# EAGLE design Carduino_328 (EAGLE 6.4)
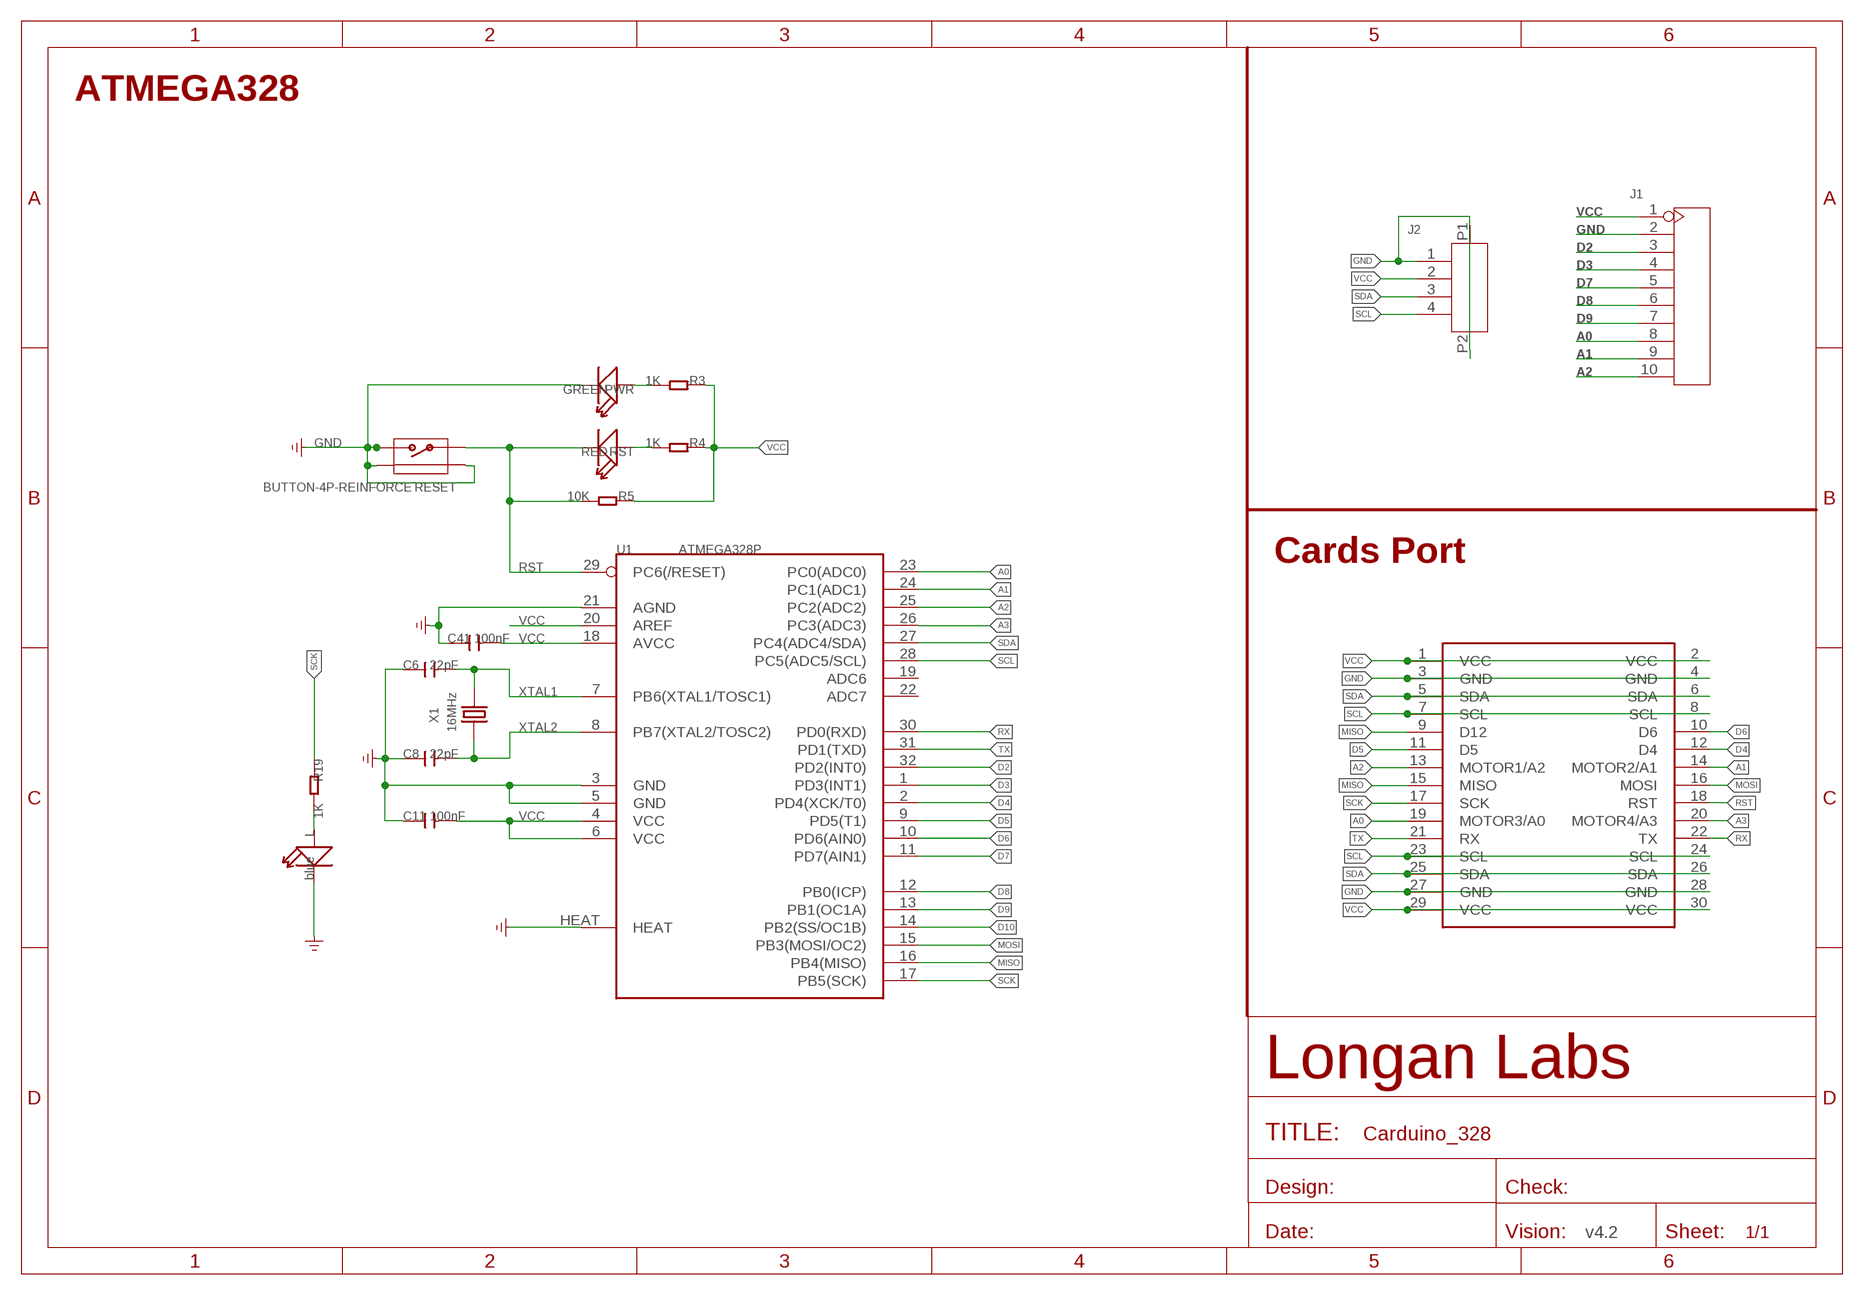
[diagram p0: schematic, sheet 1]

## Parts
C6  22pF  C-0603  [C0603]
C8  22pF  C-0603  [C0603]
C11  100nF  C-0603  [C0603]
C41  100nF  C-0603  [C0603]
J1  HEADER-10P-2.54  [H10-2.54]
J2  HEADER-4P-1.0  [4P-1.0-90D]
L  blue  LED'0603'  [LED-0603]
MOUDLE1  MOUDLE-2X15P-MCU'BOARD'  [MOUDLE-2X15P-2.54]
PWR  GREEN  LED'0603'  [LED-0603]
R3  1K  R-0603  [R0603]
R4  1K  R-0603  [R0603]
R5  10K  R-0603  [R0603]
R19  1K  R-0603  [R0603]
RESET  BUTTON-4P-REINFORCE  BUTTON-4P-REINFORCE'TS-1188E'  [4P-SMD-7X3.5X3.5H]
RST  RED  LED'0603'  [LED-0603]
U1  ATMEGA328P  MEGA8  [MLF32X]
X1  16MHz  CRYSTAL'5032'  [2P-SMD-5X3.2]

## Nets
A0: J1.8 MOUDLE1.19(MOTOR3/A0) U1.23(PC0(ADC0))
A1: J1.9 MOUDLE1.14(MOTOR2/A1) U1.24(PC1(ADC1))
A2: J1.10 MOUDLE1.13(MOTOR1/A2) U1.25(PC2(ADC2))
A3: MOUDLE1.20(MOTOR4/A3) U1.26(PC3(ADC3))
D2: J1.3 U1.32(PD2(INT0))
D3: J1.4 U1.1(PD3(INT1))
D4: MOUDLE1.12(D4) U1.2(PD4(XCK/T0))
D5: MOUDLE1.11(D5) U1.9(PD5(T1))
D6: MOUDLE1.10(D6) U1.10(PD6(AIN0))
D7: J1.5 U1.11(PD7(AIN1))
D8: J1.6 U1.12(PB0(ICP))
D9: J1.7 U1.13(PB1(OC1A))
D10: U1.14(PB2(SS/OC1B))
GND: C6.1 C8.1 C11.1 C41.1 J1.2 J2.1 J2.P1 J2.P2 L.- MOUDLE1.3(GND) MOUDLE1.4(GND) MOUDLE1.27(GND) MOUDLE1.28(GND) PWR.- RESET.2 RESET.S1 RESET.S2 U1.3(GND) U1.5(GND) U1.21(AGND) U1.HEAT ; supply symbol labelled GND_POWER
MISO: MOUDLE1.9(D12) MOUDLE1.15(MISO) U1.16(PB4(MISO))
MOSI: MOUDLE1.16(MOSI) U1.15(PB3(MOSI/OC2))
N$3: L.+ R19.2
N$7: PWR.+ R3.2
N$17: R4.2 RST.+
RST: MOUDLE1.18(RST) R5.2 RESET.1 RST.- U1.29(PC6(/RESET))
RX: MOUDLE1.22(TX) U1.30(PD0(RXD))
SCK: MOUDLE1.17(SCK) R19.1 U1.17(PB5(SCK))
SCL: J2.4 MOUDLE1.7(SCL) MOUDLE1.8(SCL) MOUDLE1.23(SCL) MOUDLE1.24(SCL) U1.28(PC5(ADC5/SCL))
SDA: J2.3 MOUDLE1.5(SDA) MOUDLE1.6(SDA) MOUDLE1.25(SDA) MOUDLE1.26(SDA) U1.27(PC4(ADC4/SDA))
TX: MOUDLE1.21(RX) U1.31(PD1(TXD))
VCC: C11.2 C41.2 J1.1 J2.2 MOUDLE1.1(VCC) MOUDLE1.2(VCC) MOUDLE1.29(VCC) MOUDLE1.30(VCC) R3.1 R4.1 R5.1 U1.4(VCC) U1.6(VCC) U1.18(AVCC) U1.20(AREF)
XTAL1: C6.2 U1.7(PB6(XTAL1/TOSC1)) X1.2
XTAL2: C8.2 U1.8(PB7(XTAL2/TOSC2)) X1.1
Unconnected: U1.19(ADC6) U1.22(ADC7)

## Notes on the sheet
- ATMEGA328
- Cards Port
- v4.2

## Library data of the parts
C6 C8 C11 C41 = Discrete:C*: Ceramic Capacitors
J1 = Connector-new:HEADER-10P
J2 = Longan-Connect:HEADER-4P-1.0
L PWR RST = Discrete:LED*
MOUDLE1 = Longan-moudle:MOUDLE-2X15P-MCU
R3-R5 R19 = Discrete:R*
RESET = Discrete:BUTTON-4P-REINFORCE: TS-1188E http://www.best-dz.com/?thread-374-2.html
U1 = ICs_v54:MEGA8
X1 = Discrete:CRYSTAL*: CRYSTAL

## Net classes
1 power: width 0.152 mm, drill 0.152 mm, clearance 0.152 mm
2 gnd: width 0.152 mm, drill 0.152 mm, clearance 0.152 mm
3 usbvcc: width 0.152 mm, drill 0.152 mm, clearance 0.152 mm

## Board
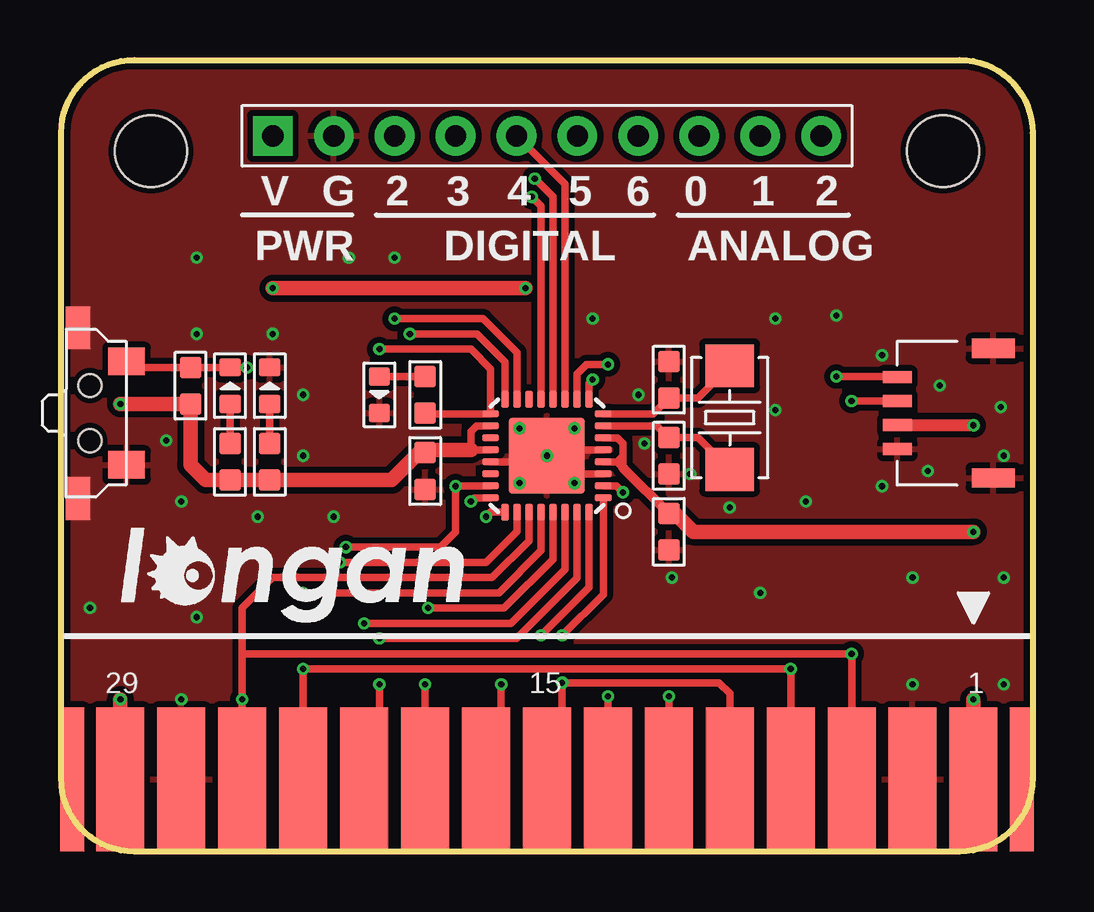
[diagram p1: board, top side]
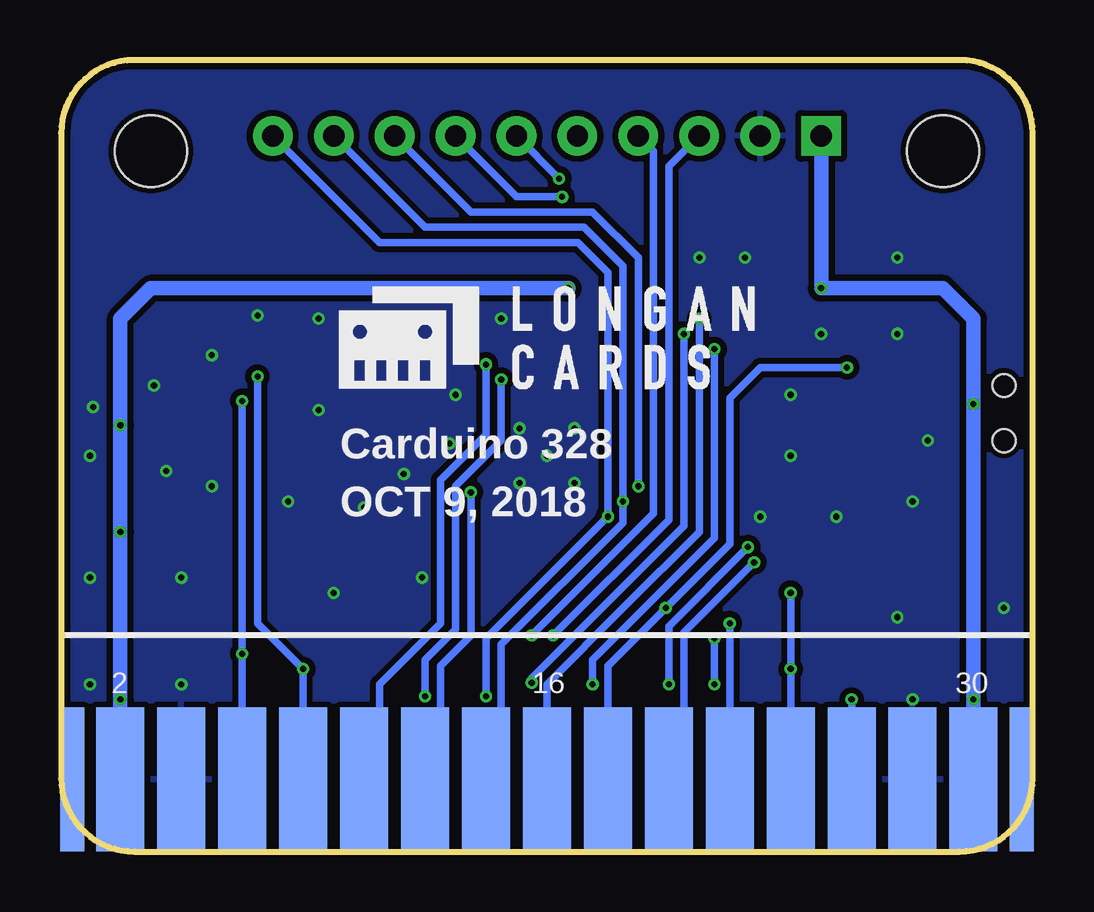
[diagram p2: board, bottom side, seen from below]

Size 40.5 x 33 mm. Coordinates in mm from the lower left corner, seen from the top.
Copper layers (1*16): Top 0.035mm / dielectric 1.5mm / Bottom 0.035mm
Design rules "SeeedStudio_2layer_DRU_no_angle_20140221": minimum track width 1mil, minimum drill 10mil, track to track 6mil, track to pad 6mil, pad to pad 6mil, via to via 6mil, smd to smd 0mil, copper to edge 10mil, drill to drill 10mil, minimum pad ring 4mil, minimum via ring 4mil, stop-mask expansion 2mil, vias tented up to drill 25mil, thermal gap 10mil

### Footprints (pad centres in the part's own frame; a part is rotated, then mirrored left to right if it is on the bottom)
C0603 = smd 0.889 x 0.889: 1 -0.762,0; 2 0.762,0
H10-2.54 = drill 0.889 pad 1.651 square: 1 0,11.43 | drill 0.889 pad 1.651: 2 0,8.89; 3 0,6.35; 4 0,3.81; 5 0,1.27; 6 0,-1.27; 7 0,-3.81; 8 0,-6.35; 9 0,-8.89; 10 0,-11.43
4P-1.0-90D = smd 1.2 x 0.5: 1 0,1.5; 2 0,0.5; 3 0,-0.5; 4 0,-1.5 | smd 1.8 x 0.8: P1 -4,2.7; P2 -4,-2.7
LED-0603 = smd 0.762 x 0.889: + -0.762,0; - 0.762,0
MOUDLE-2X15P-2.54 = smd 2 x 6: 1 17.78,-13.492; 3 15.24,-13.492; 5 12.7,-13.492; 7 10.16,-13.492; 9 7.62,-13.492; 11 5.08,-13.492; 13 2.54,-13.492; 15 0,-13.492; 17 -2.54,-13.492; 19 -5.08,-13.492; 21 -7.62,-13.492; 23 -10.16,-13.492; 25 -12.7,-13.492; 27 -15.24,-13.492; 29 -17.78,-13.492 | smd 2 x 6 bottom: 2 17.78,-13.492; 4 15.24,-13.492; 6 12.7,-13.492; 8 10.16,-13.492; 10 7.62,-13.492; 12 5.08,-13.492; 14 2.54,-13.492; 16 0,-13.492; 18 -2.54,-13.492; 20 -5.08,-13.492; 22 -7.62,-13.492; 24 -10.16,-13.492; 26 -12.7,-13.492; 28 -15.24,-13.492; 30 -17.78,-13.492 | smd 1 x 6: P1 -19.8,-13.492; P4 19.8,-13.492 | smd 1 x 6 bottom: P2 -19.8,-13.492; P3 19.8,-13.492 | hole 3: -16.51,12.7; 16.51,12.7
R0603 = smd 0.889 x 0.889: 1 -0.762,0; 2 0.762,0
4P-SMD-7X3.5X3.5H = smd 1.143 x 1.524: 1 -2.159,1.524; 2 2.159,1.524 | smd 1.778 x 1.016: S1 -3.556,-0.508; S2 3.556,-0.508 | hole 0.95: -1.15,0; 1.15,0
MLF32X = smd 0.7 x 0.3: 1 -2.35,1.75; 2 -2.35,1.25; 3 -2.35,0.75; 4 -2.35,0.25; 5 -2.35,-0.25; 6 -2.35,-0.75; 7 -2.35,-1.25; 8 -2.35,-1.75; 17 2.35,-1.75; 18 2.35,-1.25; 19 2.35,-0.75; 20 2.35,-0.25; 21 2.35,0.25; 22 2.35,0.75; 23 2.35,1.25; 24 2.35,1.75 | smd 0.3 x 0.7: 9 -1.75,-2.35; 10 -1.25,-2.35; 11 -0.75,-2.35; 12 -0.25,-2.35; 13 0.25,-2.35; 14 0.75,-2.35; 15 1.25,-2.35; 16 1.75,-2.35; 25 1.75,2.35; 26 1.25,2.35; 27 0.75,2.35; 28 0.25,2.35; 29 -0.25,2.35; 30 -0.75,2.35; 31 -1.25,2.35; 32 -1.75,2.35 | smd 3.175 x 3.175: HEAT 0,0
2P-SMD-5X3.2 = smd 1.778 x 2.032: 1 -2.159,0; 2 2.159,0

### Placement (x,y rotation side)
C6  25.33,16.5 90 top
C8  25.33,19.68 270 top
C11  25.33,13.32 90 top
C41  15.17,15.87 90 top
J1  20.25,29.84 90 top
J2  34.86,18.28 180 top
L  13.27,19.04 270 top
MOUDLE1  20.25,16.5 0 top
PWR  8.69,19.42 90 top
R3  8.69,16.25 90 top
R4  7.04,16.25 90 top
R5  5.39,19.42 90 top
R19  15.17,19.04 90 top
RESET  1.2,18.28 270 top
RST  7.04,19.42 90 top
U1  20.25,16.5 180 top
U$1  [LONGAN-CARDS-MIDDLE]  29.65,18.79 0 bottom
U$3  [LONGAN-SILK-SMALLER]  1.2,8.37 0 top
X1  27.87,18.09 270 top

### Tracks (layer width: path | path; a pad name or v marks a point on that pad's centre or on a via)
A0  (via drill 0.25 pad 0.51)
  Top 0.305: U1.23 16.46,15.25 v16.44,15.23 16.44,13.32 15.8,12.69 v11.87,12.69 | MOUDLE1.19 v15.17,6.97
  Bottom 0.305: v16.44,15.23 16.44,24.76 18.34,26.66 23.43,26.66 J1.8 | v15.17,6.97 15.17,9.39 v11.87,12.69
A1  (via drill 0.25 pad 0.51)
  Top 0.305: U1.24 17.23,14.75 v17.07,14.6
  Bottom 0.305: J1.9 25.33,26.02 18.7,26.02 17.07,24.4 v17.07,14.6 17.07,13.71 22.16,8.63 22.16,2.91 22.66,2.4 22.66,2.88 MOUDLE1.14 23.43,3.64
A2  (via drill 0.25 pad 0.51)
  Top 0.305: U1.25 17.9,14.15 v17.71,13.96 | v22.79,6.47 MOUDLE1.13
  Bottom 0.305: J1.10 27.23,25.39 18.96,25.39 17.71,24.14 v17.71,13.96 22.79,8.88 v22.79,6.47
A3  (via drill 0.25 pad 0.51)
  Top 0.305: U1.26 19,13.35 17.71,12.05 v11.61,12.05
  Bottom 0.305: MOUDLE1.20 15.17,4.94 14.54,5.58 14.54,9.13 v11.61,12.05
D2  (via drill 0.25 pad 0.51)
  Top 0.305: U1.32 22,11.01 v20,9.01
  Bottom 0.305: J1.3 15.17,28.56 15.17,13.83 v20,9.01
D3  (via drill 0.25 pad 0.51)
  Top 0.305: U1.1 22.6,10.72 v20.89,9.01
  Bottom 0.305: J1.4 15.8,29.2 15.8,14.09 v20.89,9.01
D4  (via drill 0.25 pad 0.51)
  Top 0.305: U1.2 23.15,15.25 v23.43,14.98
  Bottom 0.305: MOUDLE1.12 24.7,3.64 24.7,7.74 23.43,9.01 v23.43,14.98
D5  (via drill 0.25 pad 0.51)
  Top 0.305: MOUDLE1.11 25.33,4.69 | 25.33,4.69 25.96,5.32 | U1.9 22,19.52 v22.16,19.68 | v25.33,6.47 25.33,4.69
  Bottom 0.305: v25.33,6.47 25.33,7.99 24.06,9.26 24.06,15.23 22.16,17.14 v22.16,19.68
D6  (via drill 0.25 pad 0.51)
  Top 0.305: v22.79,20.31 21.9,20.31 21.5,19.91 U1.10
  Bottom 0.305: v22.79,20.31 22.79,17.39 24.7,15.48 24.7,9.52 27.23,6.97 27.23,3.64 MOUDLE1.10
D7
  Top 0.305: U1.11 21,27.81 J1.5
D8  (via drill 0.25 pad 0.51)
  Top 0.305: U1.12 20.5,27.3 v19.74,28.06
  Bottom 0.305: v19.74,28.06 J1.6
D9  (via drill 0.25 pad 0.51)
  Top 0.305: U1.13 20,21.48 20,21.83 20,26.91 v19.61,27.3
  Bottom 0.305: v19.61,27.3 21.52,27.3 J1.7
GND  (via drill 0.25 pad 0.51)
  Top 0.305: U1.21 20,16.25 U1.HEAT | U1.5 20.5,16.75 U1.HEAT | U1.3 20.36,15.75 20.12,15.99 20.12,16.37 U1.HEAT
  other vias: 20.25,16.5 19.11,17.64 19.11,15.36 21.39,15.36 21.39,17.64 8.19,13.96 5.01,14.6 5.64,24.76 32.31,22.34 39.3,16.5 34.22,20.69 8.82,21.58 5.64,21.58 4.38,17.14 5.01,6.34 5.64,9.77 11.99,24.76 13.9,24.76 39.17,18.53 29.14,10.79 29.77,18.41 29.77,22.21 36.63,19.42 35.49,11.42 35.49,6.97 39.3,11.42 1.2,10.15 10.09,19.04 10.09,16.5 11.36,13.96 36.12,15.87 34.22,15.23 24.31,17.01 26.22,15.74 27.87,14.34 31.05,14.6 22.16,22.21 39.3,6.97 25.46,11.42 24.06,19.04
  pour Bottom (isolate 0.254): -0.2,-0.14 41.71,-0.14 41.71,33.52 -0.2,33.52
  pour Top (isolate 0.254): -0.2,-0.14 41.71,-0.14 41.71,33.52 -0.2,33.52
MISO  (via drill 0.25 pad 0.51)
  Top 0.305: U1.16 18.5,20.41 17.33,21.58 v14.54,21.58 | MOUDLE1.9 27.87,6.59 27.43,7.04 v20.89,7.04 20.89,3.64 MOUDLE1.15
  Bottom 0.305: v14.54,21.58 14.54,13.58 20.89,7.23 v20.89,7.04
MOSI  (via drill 0.25 pad 0.51)
  Top 0.305: U1.15 19,20.8 17.58,22.21 v13.9,22.21
  Bottom 0.305: v13.9,22.21 13.9,13.32 17.07,10.15 20.25,6.97 MOUDLE1.16
N$3
  Top 0.305: R19.2 L.+
N$7
  Top 0.305: R3.2 PWR.+
N$17
  Top 0.305: R4.2 RST.+
RST  (via drill 0.25 pad 0.51)
  Top 0.305: U1.29 20.5,12.18 18.47,10.15 v15.3,10.15 | RESET.1 2.98,20.18 R5.2 RST.- v7.74,20.18
  Bottom 0.305: MOUDLE1.18 17.71,7.74 v15.3,10.15 12.63,12.82 12.63,18.91 11.36,20.18 v7.74,20.18
RX  (via drill 0.25 pad 0.51)
  Top 0.305: v12.63,9.52 18.75,9.52 21,11.77 U1.30
  Bottom 0.305: 12.38,3.26 12.38,4.94 12.63,4.69 | MOUDLE1.22 12.63,4.69 | v12.63,9.52 12.63,4.69
SCK  (via drill 0.25 pad 0.51)
  Top 0.305: v13.27,20.95 17.07,20.95 17.9,20.12 U1.17 15.2,18.25 R19.1 | v18.34,6.97 18.34,3.64 MOUDLE1.17
  Bottom 0.305: v13.27,20.95 13.27,13.07 18.34,7.99 v18.34,6.97
SCL  (via drill 0.25 pad 0.51)
  Top 0.305: v10.09,10.79 18.24,10.79 20,12.54 U1.28 | MOUDLE1.24 v10.09,7.61 v30.41,7.61 MOUDLE1.8 | v32.31,19.8 34.83,19.8 J2.4
  Bottom 0.305: MOUDLE1.24 v10.09,7.61 v10.09,10.79 | MOUDLE1.8 v30.41,7.61 32.31,9.52 v32.31,19.8
SDA  (via drill 0.25 pad 0.51)
  Top 0.305: U1.27 19.5,12.96 17.96,11.42 8.82,11.42 7.55,10.15 7.55,8.24 | MOUDLE1.26 v7.55,6.34 7.55,8.24 | MOUDLE1.6 v32.95,8.24 7.55,8.24 | v32.95,18.79 34.85,18.79 J2.3
  Bottom 0.305: v7.55,6.34 MOUDLE1.26 | MOUDLE1.6 v32.95,8.24 v32.95,18.79
TX  (via drill 0.25 pad 0.51)
  Top 0.305: U1.31 21.5,11.41 18.97,8.88 v13.27,8.88 | 13.27,5.58 12.63,4.94 MOUDLE1.21 13.01,2.63 13.01,2.28 13.27,2.53 v13.27,6.97
  Bottom 0.305: v13.27,8.88 v13.27,6.97
VCC  (via drill 0.25 pad 0.51)
  Top 0.305: U1.4 23.17,16.25 | 23.17,16.25 23.43,15.99 23.43,16.5 | U1.6 23.18,17.25 23.43,17.01 23.43,16.5 | 23.17,16.25 23.18,16.25 23.43,16.5 | U1.20 17.07,16.75 17.07,17.52 17.31,17.75 U1.18
  Top 0.406: 23.43,15.99 C11.2
  Top 0.508: J2.2 v38.02,17.78 v38.03,17.77 | C11.2 25.58,14.09
  Top 0.61: v8.82,23.48 v19.36,23.48 | 17.07,16.75 15.29,16.75 C41.2 14.92,16.63 13.77,15.48 R3.1 | R3.1 R4.1 6.03,15.48 5.39,16.12 R5.1 v2.47,18.66 | R3.1 8.95,15.48 | v38.03,13.32 26.35,13.32 25.58,14.09 | MOUDLE1.30 v2.47,6.34 | v38.03,6.34 MOUDLE1.2
  Bottom 0.61: v19.36,23.48 36.76,23.48 38.03,22.21 v38.03,17.77 v38.03,13.32 v38.03,6.34 MOUDLE1.2 | J1.1 v8.82,23.48 3.74,23.48 2.47,22.21 v2.47,18.66 v2.47,6.34 MOUDLE1.30
XTAL1
  Top 0.305: U1.7 24.84,17.75 C6.2 26.54,17.26 X1.2
XTAL2
  Top 0.305: U1.8 24.67,18.25 C8.2 26.54,18.91 X1.1

### Text on the board
tPlace: V | G | 2 | 3 | 4 | 5 | 6 | 0 | 1 | 2 | PWR | DIGITAL | ANALOG
bPlace: Carduino 328 | OCT 9, 2018